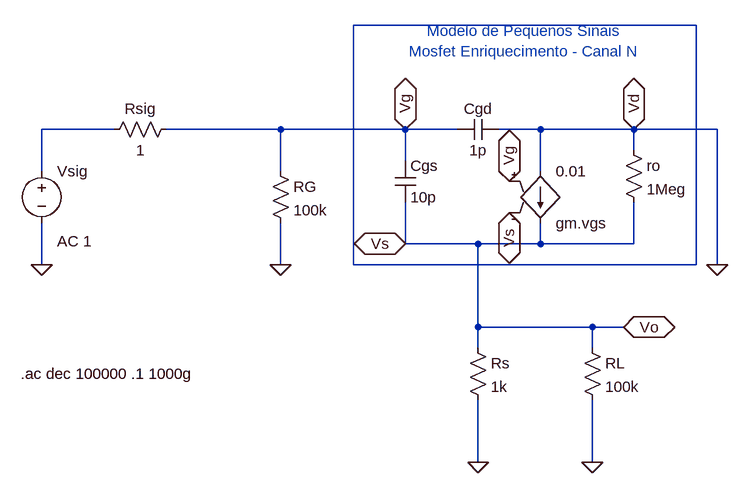
[diagram p0: schematic Dreno_Comum_Altas_Frequencias.asc]
Dreno_Comum_Altas_Frequencias.asc, the LTspice schematic file:
Version 4
SHEET 1 1560 680
WIRE 1040 -80 512 -80
WIRE 144 80 32 80
WIRE 400 80 224 80
WIRE 592 80 400 80
WIRE 672 80 592 80
WIRE 800 80 736 80
WIRE 944 80 800 80
WIRE 1072 80 944 80
WIRE 944 112 944 80
WIRE 592 128 592 80
WIRE 32 144 32 80
WIRE 400 144 400 80
WIRE 800 144 800 80
WIRE 592 256 592 192
WIRE 704 256 592 256
WIRE 800 256 800 224
WIRE 800 256 704 256
WIRE 944 256 944 192
WIRE 944 256 800 256
WIRE 32 288 32 224
WIRE 400 288 400 224
WIRE 512 288 512 -80
WIRE 1040 288 1040 -80
WIRE 1040 288 512 288
WIRE 1072 288 1072 80
WIRE 704 384 704 256
WIRE 880 384 704 384
WIRE 928 384 880 384
WIRE 704 416 704 384
WIRE 880 416 880 384
WIRE 704 592 704 496
WIRE 880 592 880 496
FLAG 32 288 0
FLAG 400 288 0
FLAG 752 160 Vg
IOPIN 752 160 BiDir
FLAG 752 208 Vs
IOPIN 752 208 BiDir
FLAG 592 80 Vg
IOPIN 592 80 BiDir
FLAG 592 256 Vs
IOPIN 592 256 BiDir
FLAG 1072 288 0
FLAG 944 80 Vd
IOPIN 944 80 BiDir
FLAG 704 592 0
FLAG 928 384 Vo
IOPIN 928 384 BiDir
FLAG 880 592 0
SYMBOL voltage 32 128 R0
WINDOW 123 24 124 Left 2
WINDOW 39 0 0 Left 0
SYMATTR Value2 AC 1
SYMATTR InstName Vsig
SYMATTR Value ""
SYMBOL res 240 64 R90
WINDOW 0 0 56 VBottom 2
WINDOW 3 32 56 VTop 2
SYMATTR InstName Rsig
SYMATTR Value 1
SYMBOL res 384 128 R0
SYMATTR InstName RG
SYMATTR Value 100k
SYMBOL res 928 96 R0
SYMATTR InstName ro
SYMATTR Value 1Meg
SYMBOL cap 576 128 R0
SYMATTR InstName Cgs
SYMATTR Value 10p
SYMBOL cap 736 64 R90
WINDOW 0 0 32 VBottom 2
WINDOW 3 32 32 VTop 2
SYMATTR InstName Cgd
SYMATTR Value 1p
SYMBOL g2 800 240 M180
SYMATTR InstName gm.vgs
SYMATTR Value 0.01
SYMBOL res 688 400 R0
SYMATTR InstName Rs
SYMATTR Value 1k
SYMBOL res 864 400 R0
SYMATTR InstName RL
SYMATTR Value 100k
TEXT 0 456 Left 2 !.ac dec 100000 .1 1000g
TEXT 776 -56 Center 2 ;Modelo de Pequenos Sinais\nMosfet Enriquecimento - Canal N

The netlist it stands for:
* Dreno_Comum_Altas_Frequencias.asc
Vsig N002 0 AC 1
Rsig Vg N002 1
RG Vg 0 100k
ro 0 Vo 1Meg
Cgs Vg Vo 10p
Cgd 0 Vg 1p
gm.vgs 0 Vo Vg Vo 0.01
Rs Vo 0 1k
RL Vo 0 100k
.ac dec 100000 .1 1000g
* Modelo de Pequenos Sinais
* Mosfet Enriquecimento - Canal N
.backanno
.end